# Altium schematic sheet Additions.SchDoc
size A4
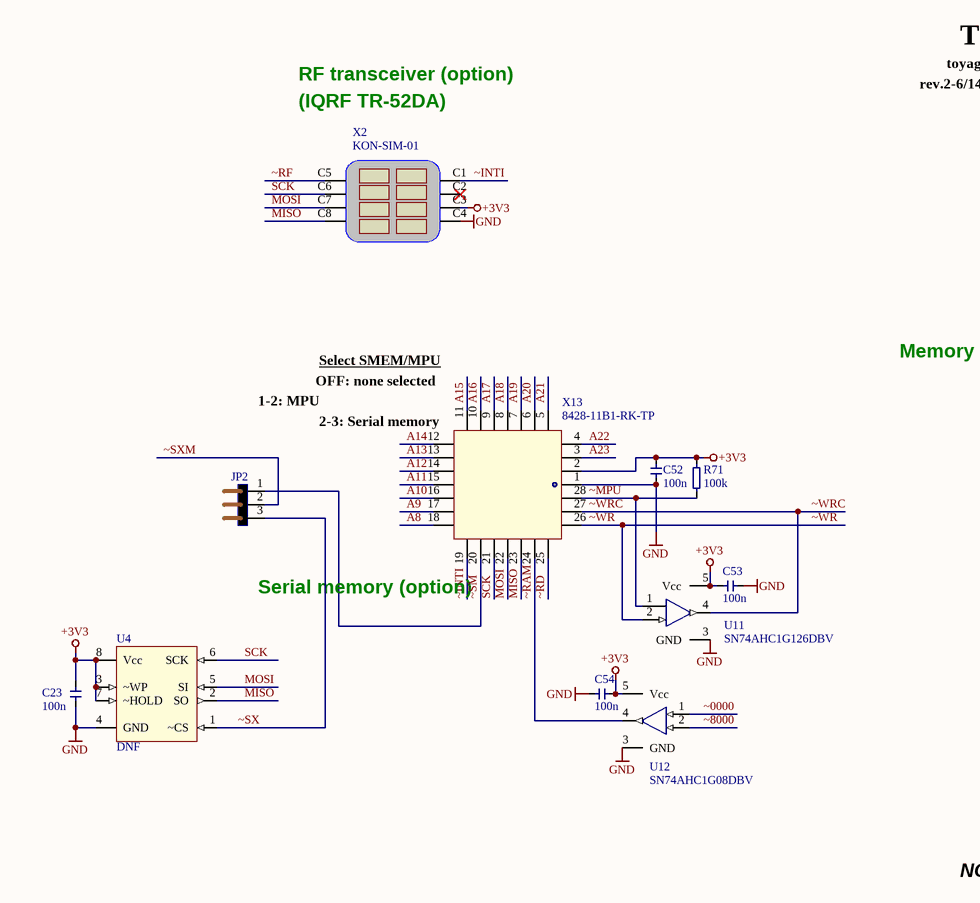
[diagram p0: Additions.SchDoc]

## Parts
C23  100n  [_0805]
C52  100n  [_0805]
C53  100n  [_0805]
C54  100n  [_0805]
JP2  Jumper 3  [2011-1X03S]  (value not drawn)
R71  100k  [_0805]
U4  DNF  [SOIC127P760-8N]
U11  SN74AHC1G126DBV  [SOT23-5]
U12  SN74AHC1G08DBV  [SOT23-5]
X2  KON-SIM-01  [KON-SIM-01]
X13  8428-11B1-RK-TP  [PLCC28-T/H socket]

## Nets
+3V3: C23.1 C52.1 C53.1 C54.2 R71.2 U4.3(~WP) U4.7(~HOLD) U4.8(Vcc) U11.5(Vcc) U12.5(Vcc) X2.C3 X13.2
GND: C23.2 C52.2 C53.2 C54.1 U4.4(GND) U11.3(GND) U12.3(GND) X2.C4 X13.1
A8: X13.18
A9: X13.17
A10: X13.16
A11: X13.15
A12: X13.14
A13: X13.13
A14: X13.12
A15: X13.11
A16: X13.10
A17: X13.9
A18: X13.8
A19: X13.7
A20: X13.6
A21: X13.5
A22: X13.4
A23: X13.3
MISO: U4.2(SO) X2.C8 X13.23
MOSI: U4.5(SI) X2.C7 X13.22
SCK: U4.6(SCK) X2.C6 X13.21
~0000: U12.1
~8000: U12.2
~INTI: X2.C1 X13.19
~MPU: R71.1 U11.1(OE) X13.28
~RAM: U12.4 X13.24
~RD: X13.25
~RF: X2.C5
~SM: JP2.1 X13.20
~SX: JP2.3 U4.1(~CS)
~SXM: JP2.2
~WR: U11.2(A) X13.26
~WRC: U11.4 X13.27

Not connected (* = marked no-connect by the designer): X2 C2*

## Notes on the sheet
- RF transceiver (option)
- rev.2-6/14
- toyaga@mail.com
- Toyaga 16z
- (IQRF TR-52DA)
- Select SMEM/MPU
- Memory protection unit (option)
- 1-2: MPU
- OFF: none selected
- 2-3: Serial memory
- Serial memory (option)
- NOTE: 'Serial memory' and 'Memory protection unit' options are mutually exclusive

## Library data of the parts
C23 C52-C54 = Capacitor
JP2 = Jumper 3: 2.54mm square pin header/jumper
R71 = Resistor
U4 = SPI Flash 8pin: Standard 8-pin SPI flash memory
U11 = SN74xxx1G126: Buffer gate with non-invertinng Enable input; Manufacturer: Texas Instruments
U12 = SN74xxx1G08: 2-INPUT AND GATE; Manufacturer: Texas Instruments
X2 = SIM/microSIM (8-pin): SIM/microSIM 6-pin connector
X13 = PLCC28 socket: PLCC28 T/H socket